# Altium schematic sheet Drive.SchDoc: Myon Deco - Leg Drive
size A; DrawnBy: Matias Lopez; Revision: Prototype; SheetNumber: 3; SheetTotal: 7
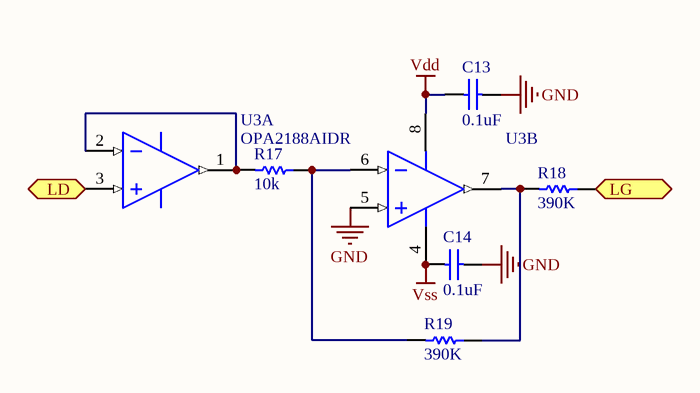
[diagram p0: Drive.SchDoc]

## Parts
C13  value 0.1uF  [C0805]  (hidden comment: Cap)
C14  value 0.1uF  [C0805]  (hidden comment: Cap)
R17  value 10k  [C1206]  (hidden comment: Res1)
R18  value 390K  [C1206]  (hidden comment: Res1)
R19  value 390K  [C1206]  (hidden comment: Res1)
U3  OPA2188AIDR  [TI-D8_N]  (parts A,B of 2)

## Ports
LD (out), LG (in)

## Nets
GND: C13.1 C14.1 U3.5(IN_B+)
Vdd: C13.2 U3.8(V+)
Vss: C14.2 U3.4(V-)
LD: U3.3(IN_A+) ; port LD
LG: R18.1 ; port LG
NetR17_1: R17.1 R19.2 U3.6(IN_B-)
NetR17_2: R17.2 U3.1(OUT_A) U3.2(IN_A-)
NetR18_2: R18.2 R19.1 U3.7(OUT_B)

## Library data of the parts
C13 C14 = Cap: Capacitor; Published: 8-Jun-2000; LatestRevisionDate: 17-Jul-2002; LatestRevisionNote: Re-released for DXP Platform.; PackageReference: RAD-0.3; Publisher: Altium Limited; PackageDescription: Radial Cap, Thru-Hole; 2 Leads; 0.3 in Pin Spacing
R17-R19 = Res1: Resistor; Published: 8-Jun-2000; LatestRevisionDate: 17-Jul-2002; LatestRevisionNote: Re-released for DXP Platform.; PackageReference: AXIAL-0.3; Publisher: Altium Limited; PackageDescription: Axial Device, Thru-Hole; 2 Leads; 0.3 in Pin Spacing
U3 = OPA2188AIDR: 0.03 uV/degC, 6 uV Vos, Low Noise, Rail-to-Rail Output, Zero-Drift Operational Amplifier, 4 to 36 V, -40 to 105 degC, 8-pin SOIC (D8), Green (RoHS & no Sb/Br); Manufacturer: Texas Instruments; CMRR(Min)(dB): 120; GBW(Typ)(MHz): 2; IIB(Max)(pA): 850; Iq per channel(Max)(mA): 0.475; Offset Drift(Typ)(uV/C): 0.03; Packing: LARGE T&R; Rating: Catalog; Slew Rate(Typ)(V/us): 0.8; Sub Family: High Supply Voltage Amplifier (>=30V), Low Noise Amp (<=10nV/rtHz), Low Offset Voltage Amplifier (<=500uV), Low Power Amp (<=500uA), Precision Amplifier, Zero Drift Precision Amplifier; Total Supply Voltage(Max)(+5V is 5, +/-5V is 10): 36; Total Supply Voltage(Min)(+5V is 5, +/-5V is 10): 4; Vio (25C)(Max)(mV): 0.025; DatasheetVersion: SBOS525B; PackageVersion: 4040047-3/M, 06/2011; PackageReference: D8; PackageDescription: 8-Pin Plastic Small Outline, Body 4.9 x 3.9 mm, Pitch 1.27 mm; Supplier 1: Digi-Key; Supplier Part Number 1: 296-29454-2-ND; Supplier 2: Digi-Key; Supplier Part Number 2: 296-29454-1-ND; Supplier 3: Digi-Key; Supplier Part Number 3: 296-29454-6-ND; Supplier 4: Newark; Supplier Part Number 4: 61T5956; Supplier 5: Mouser; Supplier Part Number 5: 595-OPA2188AIDR; Eco-Plan: Green (RoHS & no Sb/Br); Number of Channels: 2; Mounting Technology: Surface Mount; Code_JEDEC: MS-012; PartNumber: OPA2188AIDR; ComponentLink1Description: Manufacturer URL; ComponentLink1URL: http://www.ti.com/; ComponentLink2Description: Datasheet; ComponentLink2URL: http://www.ti.com/lit/ds/symlink/opa2188.pdf; ComponentLink3Description: Package Specification; ComponentLink3URL: http://www.ti.com/litv/pdf/msoi002j